# EAGLE design copycat_switch (EAGLE 9.2.0)
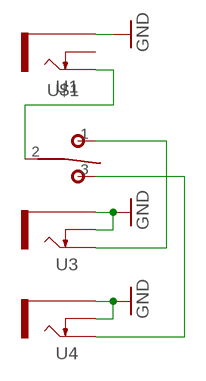
[diagram p0: schematic, sheet 1]

## Parts
U1  THONKICONNNEW  [WQP-PJ301M-12_JACK]
U3  THONKICONNNEW  [WQP-PJ301M-12_JACK]
U4  THONKICONNNEW  [WQP-PJ301M-12_JACK]
U$1  T-80-T-SPDT-ON-OFF-ON  [M9040P]

## Nets
GND: U1.P$3_SLEEVE(SLEEVE) U3.P$2_SWITCH(SWITCH) U3.P$3_SLEEVE(SLEEVE) U4.P$2_SWITCH(SWITCH) U4.P$3_SLEEVE(SLEEVE)
N$1: U1.P$1_TIP(TIP) U$1.2(P)
N$2: U4.P$1_TIP(TIP) U$1.3(S)
N$3: U3.P$1_TIP(TIP) U$1.1(O)
Unconnected: U1.P$2_SWITCH(SWITCH)

## Library data of the parts
U1 U3 U4 = MusicThingModular:THONKICONN: 3.5mm socket for Eurorack modular synths
U$1 = MusicThingModular:T-80-T-SPDT-ON-OFF-ON

## Board
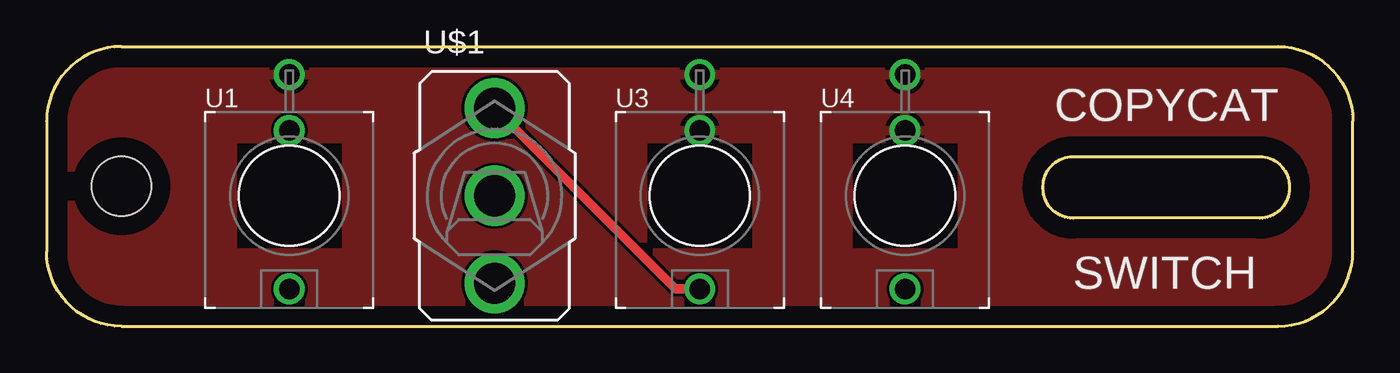
[diagram p1: board, top side]
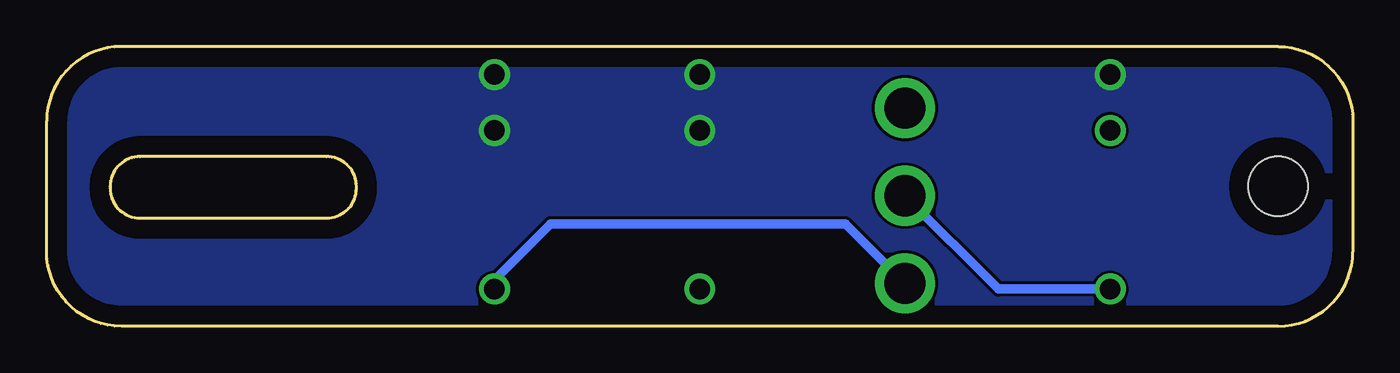
[diagram p2: board, bottom side, seen from below]

Size 70 x 15 mm. Coordinates in mm from the lower left corner, seen from the top.
Outline: 4,15 66,15 arc-90 70,11 70,4 arc-90 66,0 4,0 arc-90 0,4 0,11 arc-90 4,15
Outline: 55,5.8 arc-90 53.4,7.4 53.4,7.5 arc-90 55,9.1 65,9.1 arc-90 66.6,7.5 66.6,7.4 arc-90 65,5.8 55,5.8
Copper layers (1*16): Top 0.035mm / dielectric 1.5mm / Bottom 0.035mm
Design rules "default": minimum track width 6mil, minimum drill 0.35mm, track to track 6mil, track to pad 6mil, pad to pad 6mil, via to via 6mil, smd to smd 6mil, copper to edge 40mil, drill to drill 6mil, minimum pad ring 10mil, minimum via ring 8mil, stop-mask expansion 4mil, vias tented up to drill 0mil, thermal gap 10mil
Holes 3.2 mm at 4,7.5

### Footprints (pad centres in the part's own frame; a part is rotated, then mirrored left to right if it is on the bottom)
WQP-PJ301M-12_JACK = drill 1.1: P$1_TIP 0,5; P$2_SWITCH 0,-3.5; P$3_SLEEVE 0,-6.5
M9040P = drill 2.2: 1 0,4.699 | drill 2.2 pad 3: 2 0,0; 3 0,-4.699

### Placement (x,y rotation side)
U1  13,7 180 top
U3  35,7 180 top
U4  46,7 180 top
U$1  24,7 0 top

### Tracks (layer width: path | path; a pad name or v marks a point on that pad's centre or on a via)
GND
  pour Top: 0,15.5 0,-0.5 70,-0.5 70,15.5
  pour Bottom (no thermals): 0,15.5 0,-0.5 70,-0.5 70,15.5
N$1
  Bottom 0.508: U1.P$1_TIP 19,2 U$1.2
N$2
  Bottom 0.508: U$1.3 27.2,5.5 43,5.5 46,2.5 U4.P$1_TIP
N$3
  Top 0.508: U$1.1 33.7,2 U3.P$1_TIP

### Text on the board
tPlace: COPYCAT | SWITCH